# EAGLE design USB-C-touch (EAGLE 9.5.2)
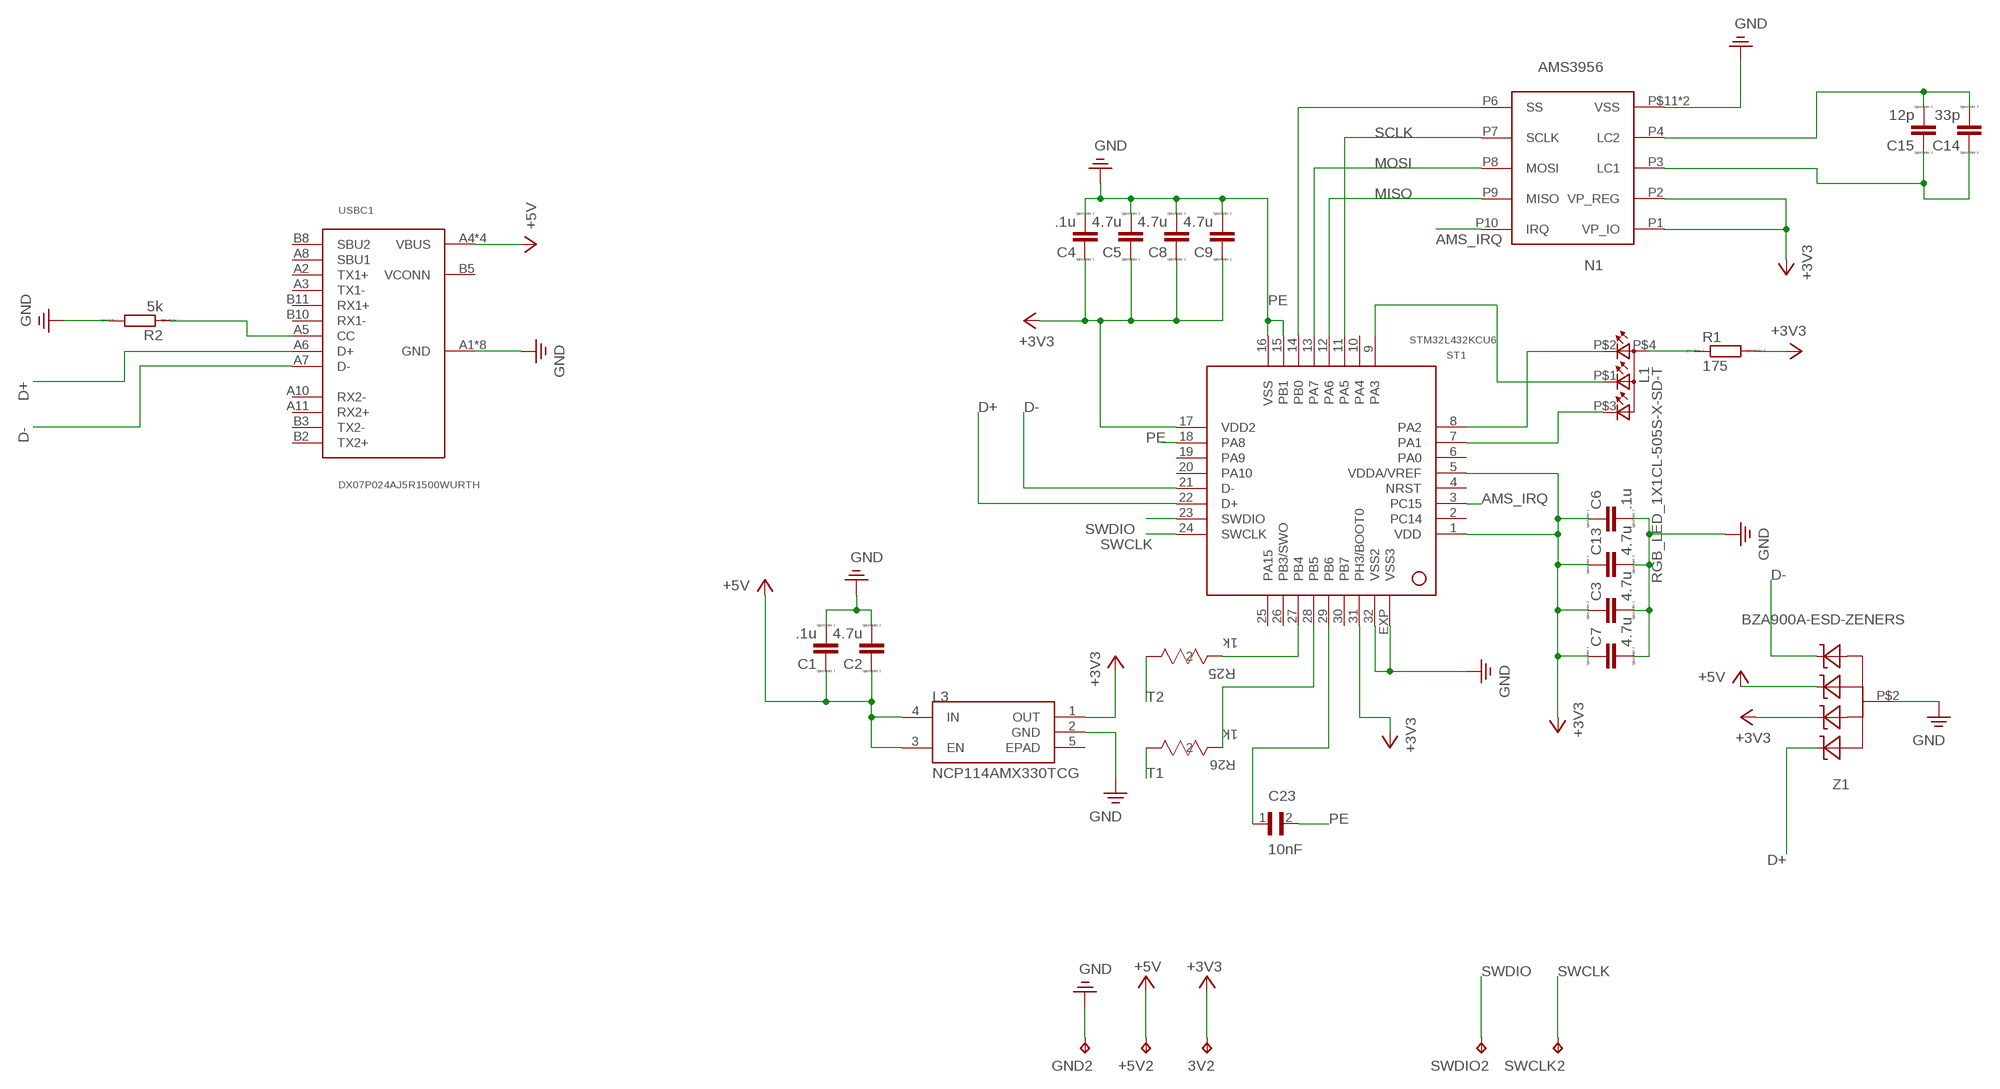
[diagram p0: schematic, sheet 1]

## Parts
3V2  TEST_POINT  [B1,27]
+5V2  TEST_POINT  [B1,27]
C1  .1u  CAPACITOR  [C0402]
C2  4.7u  CAPACITOR  [C0402]
C3  4.7u  CAPACITOR  [C0402]
C4  .1u  CAPACITOR  [C0402]
C5  4.7u  CAPACITOR  [C0402]
C6  .1u  CAPACITOR  [C0402]
C7  4.7u  CAPACITOR  [C0402]
C8  4.7u  CAPACITOR  [C0402]
C9  4.7u  CAPACITOR  [C0402]
C13  4.7u  CAPACITOR  [C0402]
C14  33p  CAPACITOR  [C0402]
C15  12p  CAPACITOR  [C0402]
C23  10nF  GRM2195C1H103FA01D  [CAPC2012X95N]
GND2  TEST_POINT  [B1,27]
L1  RGB_LED_1X1CL-505S-X-SD-T  [CL-505S-X-SD-T]
L3  NCP114AMX330TCG  [REG_NCP114AMX330TCG]
N1  AMS3956  [MLPD3X3]
R1  175  RESISTOR  [R0402]
R2  5k  RESISTOR  [R0402]
R25  1k  RC0402FR-071KLRC0402N-L  [RC0402N-L]
R26  1k  RC0402FR-071KLRC0402N-L  [RC0402N-L]
ST1  STM32L432KCU6  [QFN32]
SWCLK2  TEST_POINT  [B1,27]
SWDIO2  TEST_POINT  [B1,27]
USBC1  DX07P024AJ5R1500WURTH  [WüRTH_632712000112]
Z1  BZA900A-ESD-ZENERS  [BZA900A]

## Nets
+3V3: 3V2.TP C3.1 C4.1 C5.1 C6.1 C7.1 C8.1 C9.1 C13.1 L3.1(OUT) N1.P1(VP_IO) N1.P2(VP_REG) R1.2 ST1.1(VDD) ST1.5(VDDA/VREF) ST1.17(VDD2) ST1.31(PH3/BOOT0) Z1.P$5(C1)
+5V: +5V2.TP C1.1 C2.1 L3.3(EN) L3.4(IN) USBC1.A4(VBUS) USBC1.A9(VBUS) USBC1.B4(VBUS) USBC1.B9(VBUS) Z1.P$1(C)
AMS_CS1: N1.P6(SS) ST1.14(PB0)
AMS_IRQ: N1.P10(IRQ) ST1.3(PC15)
D+: ST1.22(D+) USBC1.A6(D+) Z1.P$3(C3)
D-: ST1.21(D-) USBC1.A7(D-) Z1.P$4(C2)
MISO: N1.P9(MISO) ST1.12(PA6)
MOSI: N1.P8(MOSI) ST1.13(PA7)
N$1: R2.1 USBC1.A5(CC)
N$2: L1.P$4(A2) R1.1
N$3: L1.P$2(CRED) ST1.8(PA2)
N$4: L1.P$1(CBLUE) ST1.9(PA3)
N$5: L1.P$3(CGREEN) ST1.7(PA1)
N$8: C14.2 C15.2 N1.P4(LC2)
N$9: C14.1 C15.1 N1.P3(LC1)
PE: C1.2 C2.2 C3.2 C4.2 C5.2 C6.2 C7.2 C8.2 C9.2 C13.2 C23.2 GND2.TP L3.2(GND) N1.P5(VSS) N1.P$11(VSS) R2.2 ST1.15(PB1) ST1.16(VSS) ST1.18(PA8) ST1.32(VSS2) ST1.EXP(VSS3) USBC1.A1(GND) USBC1.A12(GND) USBC1.B1(GND) USBC1.B12(GND) USBC1.P_GND1(GND) USBC1.P_GND2(GND) USBC1.P_GND3(GND) USBC1.P_GND4(GND) Z1.P$2 ; supply symbol labelled GND
S$2: R26.2 ST1.28(PB5)
S$4: R25.2 ST1.27(PB4)
S$5: C23.1 ST1.29(PB6)
SCLK: N1.P7(SCLK) ST1.11(PA5)
SWCLK: ST1.24(SWCLK) SWCLK2.TP
SWDIO: ST1.23(SWDIO) SWDIO2.TP
T1: R26.1
T2: R25.1
Unconnected: L3.5(EPAD) ST1.2(PC14) ST1.4(NRST) ST1.6(PA0) ST1.10(PA4) ST1.19(PA9) ST1.20(PA10) ST1.25(PA15) ST1.26(PB3/SWO) ST1.30(PB7) USBC1.A2(TX1+) USBC1.A3(TX1-) USBC1.A8(SBU1) USBC1.A10(RX2-) USBC1.A11(RX2+) USBC1.B2(TX2+) USBC1.B3(TX2-) USBC1.B5(VCONN) USBC1.B8(SBU2) USBC1.B10(RX1-) USBC1.B11(RX1+)

## Library data of the parts
3V2 +5V2 GND2 SWCLK2 SWDIO2 = efm-fido:TEST_POINT
C1-C9 C13-C15 = efm-fido:CAPACITOR
C23 = GRM2195C1H103FA01D:GRM2195C1H103FA01D: .01UF 50V 1% 0805; DESCRIPTION: Multilayer Ceramic Capacitor, GRM Series, 0.01 F, 1%, C0G / NP0, 50 V, 0805 [2012 Metric]; DIGI-KEY_PART_NUMBER: 490-8295-1-ND; DIGI-KEY_PURCHASE_URL: https://www.digikey.com/product-detail/en/murata-electronics/GRM2195C1H103FA01D/490-8295-1-ND/4380589?utm_source=snapeda&utm_medium=aggregator&utm_campaign=symbol; MF: Murata; MP: GRM2195C1H103FA01D; PACKAGE: 2012 Murata
L1 = efm-fido:RGB_LED_1X1: EAST1616RGBA3
L3 = efm-fido:NCP114AMX330TCG: CMOS Low Dropout Regulator, 300 mA 3.3V, Active Discharge; AVAILABILITY: Unavailable; DESCRIPTION: CMOS Low Dropout Regulator _LDO_, 300 mA 3.3V, Active Discharge; MF: ON Semiconductor; MP: NCP114AMX330TCG; PACKAGE: UDFN-4 ON Semiconductor; PRICE: None
N1 = efm-fido:AMS3956
R1 R2 = efm-fido:RESISTOR
R25 R26 = ultra_librarian:RC0402FR-071KL; MANUFACTURER_PART_NUMBER: RC0402FR071KL; VENDOR: Yageo
ST1 = efm-fido:STM32L432KCU6
USBC1 = efm-fido:DX07P024AJ5R1500
Z1 = efm-fido:BZA900A-ESD-ZENERS

## Net classes
0 default: width 0.152 mm, drill 0.203 mm, clearance 0.102 mm

## Board
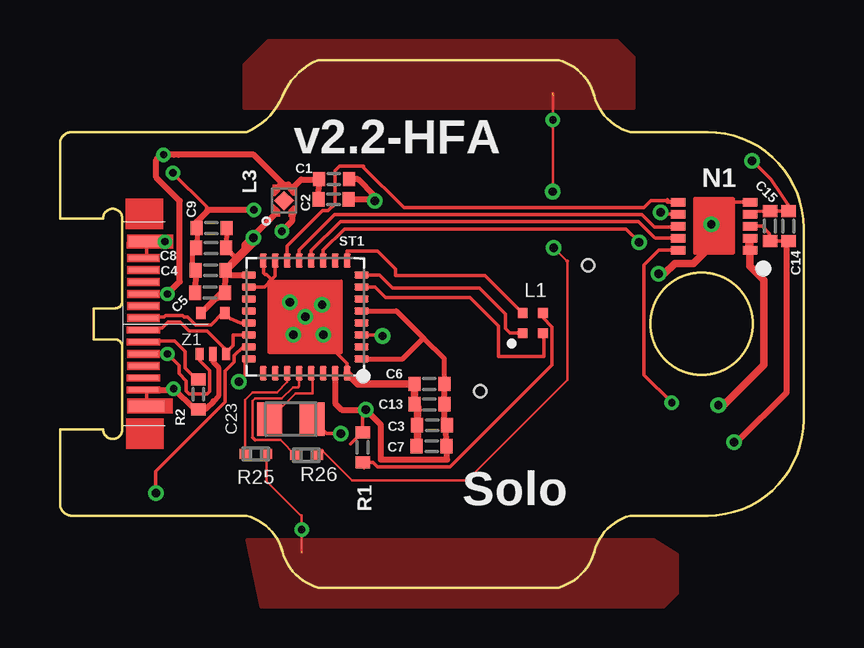
[diagram p1: board, top side]
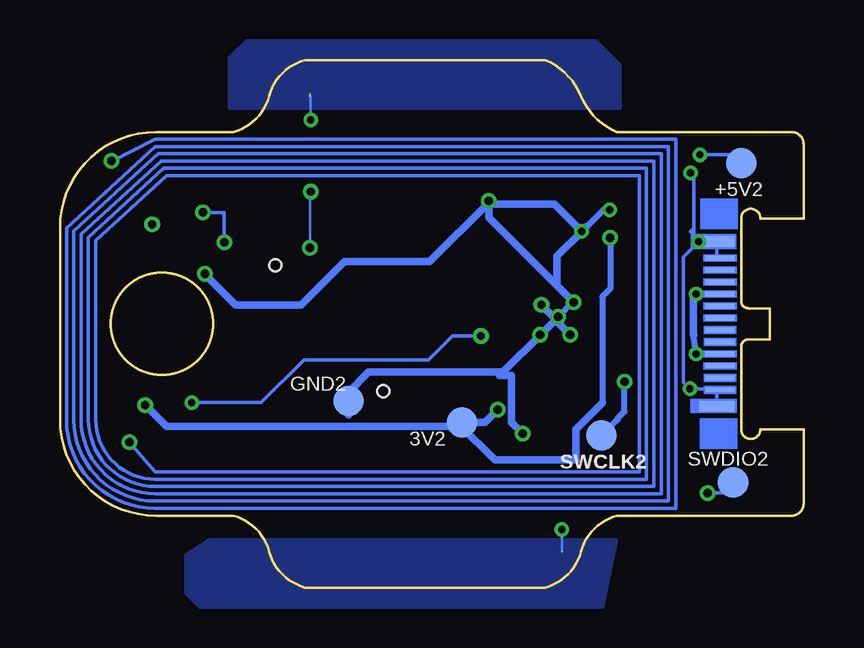
[diagram p2: board, bottom side, seen from below]

Size 31 x 22 mm. Coordinates in mm from the lower left corner, seen from the top.
Outline: 27,19 23.78,19 arc-60 22.28,20.5 arc60 20.78,22 10.78,22 arc45 9.28,20.5 arc-45 7.78,19 0.5,19 arc90 0,18.5 0,15.4 1.8,15.4 arc-180 2.6,15.4 2.6,11.95 arc-90 2.3,11.65 1.4,11.65 1.4,10.35 2.3,10.35 arc-90 2.6,10.05 2.6,6.6 arc-180 1.8,6.6 0,6.6 0,3.5 arc90 0.5,3 7.78,3 arc-60 9.28,1.5 arc60 10.78,0 20.78,0 arc60 22.28,1.5 arc-60 23.78,3 27,3 arc90 31,7 31,15 arc90 27,19
Outline: circle at 26.75,11 radius 2.12
Copper layers (1*16): Top 0.035mm / dielectric 0.8mm / Bottom 0.035mm
Design rules "default *": minimum track width 4mil, minimum drill 0.3mm, track to track 4mil, track to pad 4mil, pad to pad 4mil, via to via 4mil, smd to smd 0mil, copper to edge 0mil, drill to drill 6mil, minimum pad ring 4mil, minimum via ring 0.15mm, stop-mask expansion 4mil, vias tented up to drill 0mil, thermal gap 10mil
Holes 0.5 mm at 22.03,13.44 17.53,8.19

### Footprints (pad centres in the part's own frame; a part is rotated, then mirrored left to right if it is on the bottom)
B1,27 = smd 1.27 x 1.27: TP 0,0
C0402 = smd 0.5 x 0.6: 1 -0.625,0; 2 0.625,0
CAPC2012X95N = smd 1.05 x 1.38: 1 -0.888,0; 2 0.888,0
CL-505S-X-SD-T = smd 0.4 x 0.4: P$1 0.85,0; P$2 0.85,0.85; P$3 0,0.85; P$4 0,0
REG_NCP114AMX330TCG = smd 0.1 x 0.1: 1 -0.325,-0.5; 2 0.325,-0.5; 3 0.325,0.5; 4 -0.325,0.5 | smd 0.58 x 0.58 rotated 45: 5 0,0
MLPD3X3 = smd 0.6 x 0.35: P1 0,-0.54; P2 0,-1.04; P3 0,-1.54; P4 0,-2.04; P5 0,-2.54; P6 3,-2.54; P7 3,-2.04; P8 3,-1.54; P9 3,-1.04; P10 3,-0.54 | smd 0.2 x 0.2: P$11 1.6,-1.64
R0402 = smd 0.5 x 0.6: 1 -0.625,0; 2 0.625,0
RC0402N-L = smd 0.455 x 0.408: 1 -0.456,0; 2 0.456,0
QFN32 = smd 0.6 x 0.3: 1 -2.35,1.75; 2 -2.35,1.25; 3 -2.35,0.75; 4 -2.35,0.25; 5 -2.35,-0.25; 6 -2.35,-0.75; 7 -2.35,-1.25; 8 -2.35,-1.75; 17 2.35,-1.75; 18 2.35,-1.25; 19 2.35,-0.75; 20 2.35,-0.25; 21 2.35,0.25; 22 2.35,0.75; 23 2.35,1.25; 24 2.35,1.75 | smd 0.3 x 0.6: 9 -1.75,-2.35; 10 -1.25,-2.35; 11 -0.75,-2.35; 12 -0.25,-2.35; 13 0.25,-2.35; 14 0.75,-2.35; 15 1.25,-2.35; 16 1.75,-2.35; 25 1.75,2.35; 26 1.25,2.35; 27 0.75,2.35; 28 0.25,2.35; 29 -0.25,2.35; 30 -0.75,2.35; 31 -1.25,2.35; 32 -1.75,2.35 | smd 0.2 x 0.2: EXP 0,0
WüRTH_632712000112 = smd 0.2 x 1.2: A1 5.651,1.017; A2 5.152,1.021; A3 4.649,1.023; A4 4.161,1.021; A5 3.653,1.021; A6 3.157,1.021; A7 2.655,1.017; A8 2.156,1.017; A9 1.655,1.021; A10 1.159,1.023; A11 0.655,1.016; A12 0.155,1.019 | smd 0.2 x 1.2 bottom: B1 0.155,1.019; B2 0.652,1.019; B3 1.158,1.023; B4 1.655,1.021; B5 2.155,1.017; B6 2.658,1.014; B7 3.155,1.021; B8 3.655,1.019; B9 4.16,1.019; B10 4.645,1.021; B11 5.157,1.023; B12 5.646,1.015 | smd 0.45 x 1.45 bottom: P_GND1 -0.524,1.146; P_GND2 6.34,1.146 | smd 0.45 x 1.45: P_GND3 6.354,1.146; P_GND4 -0.523,1.146
BZA900A = smd 0.325 x 0.5: P$1 -0.05,0; P$3 1.05,0 | smd 0.3 x 0.6: P$2 0.5,0 | smd 0.4 x 0.5: P$4 1,1.7; P$5 0,1.7

### Placement (x,y rotation side)
3V2  14.24,6.89 0 bottom
+5V2  2.6,17.7 0 bottom
C1  11.42,17.03 0 top
C2  11.41,16.19 0 top
C3  15.52,6.77 180 top
C4  6.28,13.23 180 top
C5  6.26,12.3 180 top
C6  15.4,8.49 180 top
C7  15.5,5.9 180 top
C8  6.31,14.16 180 top
C9  6.32,14.99 180 top
C13  15.4,7.64 180 top
C14  30.37,15.07 90 top
C15  29.6,15.07 90 top
C23  9.63,7.02 0 top
GND2  18.98,7.79 0 bottom
L1  20.14,11.45 180 top
L3  9.35,16.13 0 top
N1  28.76,13.53 180 top
R1  12.62,5.85 90 top
R2  5.77,8.06 270 top
R25  8.17,5.57 180 top
R26  10.28,5.52 180 top
ST1  10.23,11.29 180 top
SWCLK2  8.43,6.34 0 bottom
SWDIO2  2.94,4.38 0 bottom
USBC1  2.47,13.9 270 top
Z1  5.88,9.74 0 top

### Tracks (layer width: path | path; a pad name or v marks a point on that pad's centre or on a via)
+3V3  (via drill 0.35)
  Top 0.152: ST1.31 11.41,8.93 | N1.P2 28.74,14.57 28.72,14.59 | 16.14,5.88 C7.1 | v12.76,7.41 12.62,7.27 R1.2 12.12,5.98 | v27.45,7.61 27.67,7.61
  Top 0.2: C9.1 6.92,14.17 C8.1 7.33,13.74
  Top 0.203: ST1.5 14.03,11.54 15.16,10.41 | 15.16,10.41 16.02,9.55 C6.1 | ST1.1 14.29,9.54 15.16,10.41
  Top 0.254: C5.1 6.9,13.12 C4.1 | C4.1 7.12,13.04 ST1.17 | C4.1 6.96,13.23 | C4.1 6.96,13.23 8.06,14.33 v8.06,14.59 | 6.48,12.04 6.88,12.21 C5.1 | C4.1 6.88,13.29 7.33,13.74 7.68,14.09 7.68,14.28 L3.1 | C6.1 C13.1 16,6.89 C3.1 16.1,6.75 C7.1 | Z1.P$5 6.74,12.3 C5.1 | ST1.31 11.48,7.68 11.75,7.41 v12.76,7.41 13.37,6.8 13.37,5.34 16.14,5.34 16.14,5.88
  Top 0.305: N1.P2 N1.P1 28.76,13.4 29.35,12.82 29.35,9.29 27.67,7.61 | 28.72,14.59 28.72,14.12
  Bottom 0.152: 8.39,7.74 8.39,7.69
  Bottom 0.254: 14.44,6.89 3V2.TP | v8.06,14.59 8.06,12.46 8.39,12.13 8.39,7.74
  Bottom 0.305: v12.76,7.41 13.28,6.89 14.44,6.89 | 3V2.TP 14.34,6.79 | 14.34,6.79 14.42,6.71 26.55,6.71 v27.45,7.61 | 8.39,7.69 9.49,6.59 9.49,5.32 12.87,5.32 14.34,6.79
+5V  (via drill 0.3)
  Top 0.152: Z1.P$1 5.83,9.46 6.25,9.04 6.25,8.18 6.14,8.07 5.39,8.07 5.27,8.2 5.27,8.62 4.96,8.92 4.96,9.26 v4.48,9.74 | v4.48,12.24 USBC1.B4 | 3.8,9.74 4.18,9.74 | 4.18,9.74 | 3.8,9.74 v4.48,9.74 | 3.26,9.73 USBC1.B9 3.8,9.74 | 4.18,9.74 v4.48,9.74
  Top 0.2: v4.48,9.74 4.18,9.74 4.17,9.75
  Top 0.203: 10.76,17.02 C1.1
  Top 0.25: L3.4 9.22,16.83 9.22,16.91 | 9.32,16.81 9.52,16.81 9.67,16.66 L3.3 10.06,17.02 10.76,17.02 | C2.1 C1.1 | USBC1.B4 3.34,12.24 3.33,12.23 | 4.72,12.48 v4.48,12.24 5,12.76 5,16.12 4.02,17.1 4.02,17.84 4.23,18.05 | 4.95,18.05 v4.32,18.05
  Top 0.254: 9.27,16.86 9.2,16.8 | 9.32,16.81 9.27,16.86 | 9.27,16.86 9.22,16.91 8.08,18.05 4.95,18.05 | 4.76,18.05 v4.32,18.05 4.23,18.05 4.19,18.05 | 3.26,9.73 3.26,9.74
  Bottom 0.152: 3.15,17.7 +5V2.TP 2.95,18.05 v4.32,18.05 | 4.59,12.24 USBC1.B4 v4.48,12.24 | 3.26,9.74 USBC1.B9 4.05,9.74 | 3.26,9.74 3.26,9.73 | 3.26,9.74 4.21,9.74 | 4.05,9.74 4.21,9.74 | 4.21,9.74 v4.48,9.74 4.05,9.74
  Bottom 0.2: 4.05,9.74 4.16,9.74
  Bottom 0.254: v4.48,9.74 4.59,10.52
  Bottom 0.305: 4.59,12.24 4.59,10.52 4.57,10.54
AMS_CS1
  Top 0.152: ST1.14 9.48,14.24 10.95,15.71 11.18,15.71 11.46,15.99 11.46,17.39 11.65,17.58 12.6,17.58 | N1.P6 25.52,16.07 | 25.52,16.07 25.44,16.07 25.33,16.18 | 12.66,17.58 12.6,17.58 | 25.52,16.07 25.32,16.07 25.24,16.14 24.64,16.14 24.34,15.84 14.34,15.84 12.6,17.58
AMS_IRQ  (via drill 0.3, 0.35)
  Top 0.152: v25.51,7.71 24.35,8.87 24.35,13.44 24.98,14.07 N1.P10 | v13.45,10.49 13.4,10.54 ST1.3
  Bottom 0.152: v25.51,7.71 22.61,7.71 20.82,9.5 15.63,9.5 14.64,10.49 v13.45,10.49
D+
  Top 0.152: ST1.22 7.23,10.54 7.23,10.09 6.93,9.79 Z1.P$3 | Z1.P$3 6.96,9.73 | Z1.P$3 7.01,9.82 6.13,10.7 5.39,10.7 5.01,11.08 4.52,11.08 4.26,10.82 3.57,10.82 USBC1.A6 3.49,10.83
D-
  Top 0.152: ST1.21 7.52,11.04 7.1,11.22 Z1.P$4 6.78,11.44 6.29,10.96 5.65,10.96 5.33,11.28 5.17,11.28 5.11,11.34 4.41,11.34 4.35,11.28 3.64,11.28 3.58,11.34 USBC1.A7 3.49,11.23
MISO
  Top 0.152: ST1.12 10.48,14.05 11.69,15.27 24.11,15.27 24.76,14.62 24.81,14.57 N1.P9
MOSI
  Top 0.152: N1.P8 25.72,15.03 24.79,15.03 24.26,15.56 15.33,15.56 15.33,15.55 11.45,15.55 9.98,14.08 ST1.13
N$1
  Top 0.152: 3.58,10.16 USBC1.A5 3.53,10.29 4.78,10.29 5.22,9.85 5.22,9.16 5.63,8.75 5.77,8.75 R2.1
N$2
  Top 0.152: 12.67,5 12.67,5.17 R1.1 13.05,5.23 13.24,5.03 16.26,5.03 20.52,9.29 20.52,10.87 20.14,11.25 L1.P$4
N$3
  Top 0.152: ST1.8 13.32,13.04 13.87,12.49 17.49,12.49 18.57,11.41 18.57,10.81 18.76,10.62 19.27,10.62 L1.P$2 19.29,10.69
N$4
  Top 0.152: ST1.9 11.98,14.04 13.25,14.04 14,13.29 14,13.02 17.72,13.02 L1.P$1
N$5
  Top 0.152: ST1.7 13.13,12.54 13.58,12.09 17.09,12.09 18.28,10.9 18.28,9.63 20.17,9.63 20.17,10.57 L1.P$3
N$7
  Bottom 0.15: 28.86,17.76 27.03,18.7 5.33,18.7 5.33,3.3 27.03,3.3 arc90 30.73,7 30.73,15 27.03,18.4 5.63,18.4 5.63,3.6 27.03,3.6 arc90 30.42,7 30.42,14.87 26.91,18.09 5.94,18.09 5.94,3.91 27.03,3.91 arc90 30.12,7 30.12,14.73 26.79,17.79 6.24,17.79 6.24,4.21 27.03,4.21 arc90 29.81,7 29.81,14.6 26.67,17.48 6.55,17.48 6.55,4.52 27.03,4.52 arc90 29.51,7 29.51,14.46 26.55,17.18 6.85,17.18 6.85,4.82 27.03,4.82 28.13,6.09
N$8  (via drill 0.35)
  Top 0.152: 28.79,15.57 N1.P4 28.86,15.67 C15.2 | C15.2 30.54,15.67 29.63,17.02 v28.86,17.8 | 29.74,15.53 C15.2 | C14.2 C15.2
N$9  (via drill 0.35)
  Top 0.152: N1.P3 29.27,15.07 29.58,14.77 29.58,14.49 C15.1 C14.1 30.29,14.39
  Top 0.25: 30.29,14.39 30.29,8.12 28.27,6.11 28.16,6.11 v28.11,6.06
PE  (via drill 0.3, 0.35)
  Top 0.152: ST1.32 11.98,9.34 10.53,10.79 10.53,10.99 | ST1.16 8.5,13.57 8.5,13.12 8.56,13.06 8.61,13.06 8.83,12.84 | 8.83,12.84 10.23,11.44 ST1.EXP | N1.P5 27.73,16.07 27.73,15.65 27.39,15.31 | v24.97,13.08 | 27.13,15.05 27.21,15.13 | 27.21,15.13 27.23,15.15 | USBC1.A12 3.61,13.87 USBC1.P_GND1 v4.37,14.42 | USBC1.P_GND3 3.61,8.12 USBC1.A1 | 27.21,15.13 N1.P$11 27.31,15.31 27.39,15.31 | 27.39,15.31 27.23,15.15 | 27.23,15.15 v27.16,15.15 | 5.57,15.08 5.72,14.93 | v4.71,17.29 6.11,15.88 6.11,15.66 | 11.67,6.38 v11.71,6.42 11.12,6.42 C23.2 | ST1.18 8.53,12.54 8.83,12.84 | ST1.15 8.98,12.99 8.83,12.84
  Top 0.2: C9.2 5.72,14.93 5.72,14.39 5.72,14.17 C8.2 5.52,13.97 5.52,13.27 5.52,13.06
  Top 0.203: Z1.P$2 6.38,9.41 6.61,9.18 6.61,7.98 6.4,7.77
  Top 0.25: C1.2 12.42,17.03 13.12,16.32 v13.12,16.13 13.06,16.19 C2.2 | v8.09,15.75 6.2,15.75 6.11,15.66 5.72,15.27 C9.2 | L3.2 9.67,15.27 v9.25,14.85 | v4.74,8.29 5.57,7.46 R2.2 6.09,7.46 6.4,7.77 | 6.4,9.72 Z1.P$2 | 5.68,14.42 5.72,14.39
  Top 0.254: v9.58,11.89 9.63,11.89 ST1.EXP 10.53,10.99 v10.98,10.54 | v10.93,11.79 9.73,11.79 v9.73,10.54 | v9.25,14.85 9.11,14.99 | L3.2 9.74,15.63 | C5.2 5.66,13.2 C4.2 5.52,13.06 | 5.52,13.27 5.65,13.4 | v4.74,8.29 4.7,8.25 USBC1.A1
  Top 0.305: 5.54,13.36 C4.2 | v24.97,13.08 25.19,13.08 25.63,13.52 26.41,13.52 27.54,14.65 27.13,15.05 | N1.P$11 27.34,15.17 | C7.2 14.92,5.92 C3.2 14.92,7.52 C13.2 C6.2 12.43,8.49 ST1.32
  Bottom 0.152: 3.69,8.26 USBC1.A1 USBC1.B12 | USBC1.A12 3.61,13.87 USBC1.P_GND1 v4.37,14.42 | v4.37,14.42 4.57,14.62 4.57,14.68 | 4.57,14.68 4.73,14.84 4.62,14.95 | 4.57,14.68 4.57,17.15 v4.71,17.29 | v4.37,14.42 5.01,13.79 5.01,8.56 v4.74,8.29 3.72,8.29 3.69,8.26 | USBC1.P_GND2 3.61,8.19 3.69,8.26
  Bottom 0.254: 3.48,13.73 USBC1.A12 | 10.33,11.29 ST1.EXP 9.63,11.89 v9.58,11.89 | v9.25,14.85 8.35,15.75 v8.09,15.75
  Bottom 0.305: 9.05,15.05 v9.25,14.85 | v9.25,14.85 10.38,15.98 12.97,15.98 v13.12,16.13 | v13.12,16.13 13.12,16.06 15.58,13.6 19.14,13.6 20.95,11.79 23.68,11.79 v24.97,13.08 | 18.98,7.19 GND2.TP 18.98,8.14 18.14,8.98 12.54,8.98 | v9.73,10.54 10.23,11.04 ST1.EXP v10.98,10.54 12.54,8.98 | v10.93,11.79 10.43,11.29 10.33,11.29 | v13.12,16.13 13.12,15.44 v9.58,11.89 10.28,12.59 10.28,13.82 v9.25,14.85 | 12.54,8.98 12.68,8.84 12.17,8.84 12.17,6.88 v11.71,6.42
  other vias: 10.23,11.29
S$2
  Top 0.102: 8.04,6.26 8.04,7.78 8.14,7.89 9.25,7.89 9.71,8.35 9.92,8.35 9.98,8.41 ST1.28 | R26.2 9.19,6.15 8.14,6.15
  Top 0.152: 8.14,6.15 8.04,6.26
S$4
  Top 0.102: R25.2 7.71,7.82 8.04,8.14 9.05,8.14 9.48,8.57 ST1.27
S$5
  Top 0.102: 10.54,8.85 10.54,8.1 9.82,8.1 C23.1
  Top 0.152: ST1.29 10.46,8.93 10.54,8.85 | C23.1 8.74,7.38
SCLK  (via drill 0.35)
  Top 0.152: 25.7,15.63 N1.P7 25.21,15.57 25.14,15.64 v25.03,15.64 | ST1.11 10.98,14.06 11.87,14.95 23.59,14.95 v24.15,14.4
  Bottom 0.152: v25.03,15.64 24.15,15.64 v24.15,14.4
SWCLK  (via drill 0.35)
  Top 0.152: v7.46,8.58 7.72,8.84 7.72,9.38 ST1.24
  Bottom 0.152: v7.46,8.58 7.41,8.63
  Bottom 0.254: SWCLK2.TP 7.76,7.01 7.76,7.05 7.46,7.34 v7.46,8.58
SWDIO  (via drill 0.35)
  Top 0.152: v4,3.94 4,4.85 6.89,7.74 6.89,9.04 7.27,9.42 7.27,9.68 7.63,10.04 ST1.23
  Bottom 0.152: v4,3.94 3.38,3.94 SWDIO2.TP
T1  (via drill 0.3, 0.35)  (1 unrouted)
  Top 0.102: v20.58,14.17 21.14,13.61 | 10.93,5.72 12.18,4.48 16.97,4.48 21.16,8.66 21.16,13.61 | v20.55,16.52 20.55,20.62
  Top 0.152: 21.14,13.61 21.16,13.61 | R26.1 10.93,5.72 | v20.54,16.51 v20.55,16.52
  Bottom 0.102: v20.54,16.51 20.58,16.47 v20.58,14.17 | v20.55,19.5 20.55,20.45
  Bottom 0.152: 20.58,20.48 20.55,20.45
  pour Bottom: 7.66,20 7.66,21.81 8.66,22.81 23.23,22.81 23.92,22.12 23.92,20
  pour Top (no thermals): 7.67,20 7.67,21.8 8.67,22.8 23.24,22.8 23.93,22.11 23.93,20
T2  (via drill 0.3)  (1 unrouted)
  Top 0.102: 10.08,3.01 10.08,2.97 | 10.08,2.97 10.08,1.46 | 10.08,2.97 8.62,4.42 R25.1
  Bottom 0.102: v10.08,2.42 10.08,1.52
  pour Bottom: 7.81,2 24.75,2 25.75,1.34 25.75,-0.26 25.18,-0.83 8.38,-0.83
  pour Top (no thermals): 7.81,2 24.75,2 25.75,1.37 25.75,-0.23 25.18,-0.8 8.38,-0.8

### Text on the board
tPlace: v2.2-HFA | Solo